# Altium schematic sheet WIFI_BLE.SchDoc: WIFI BLE
size A3; Author: Silvio Navaretti; CompanyName: ARDUINO; DrawnBy: Silvio Navaretti; Engineer: Silvio Navaretti; Organization: ARDUINO; SheetNumber: 29; SheetTotal: 51; RevAuthor: Silvio Navaretti
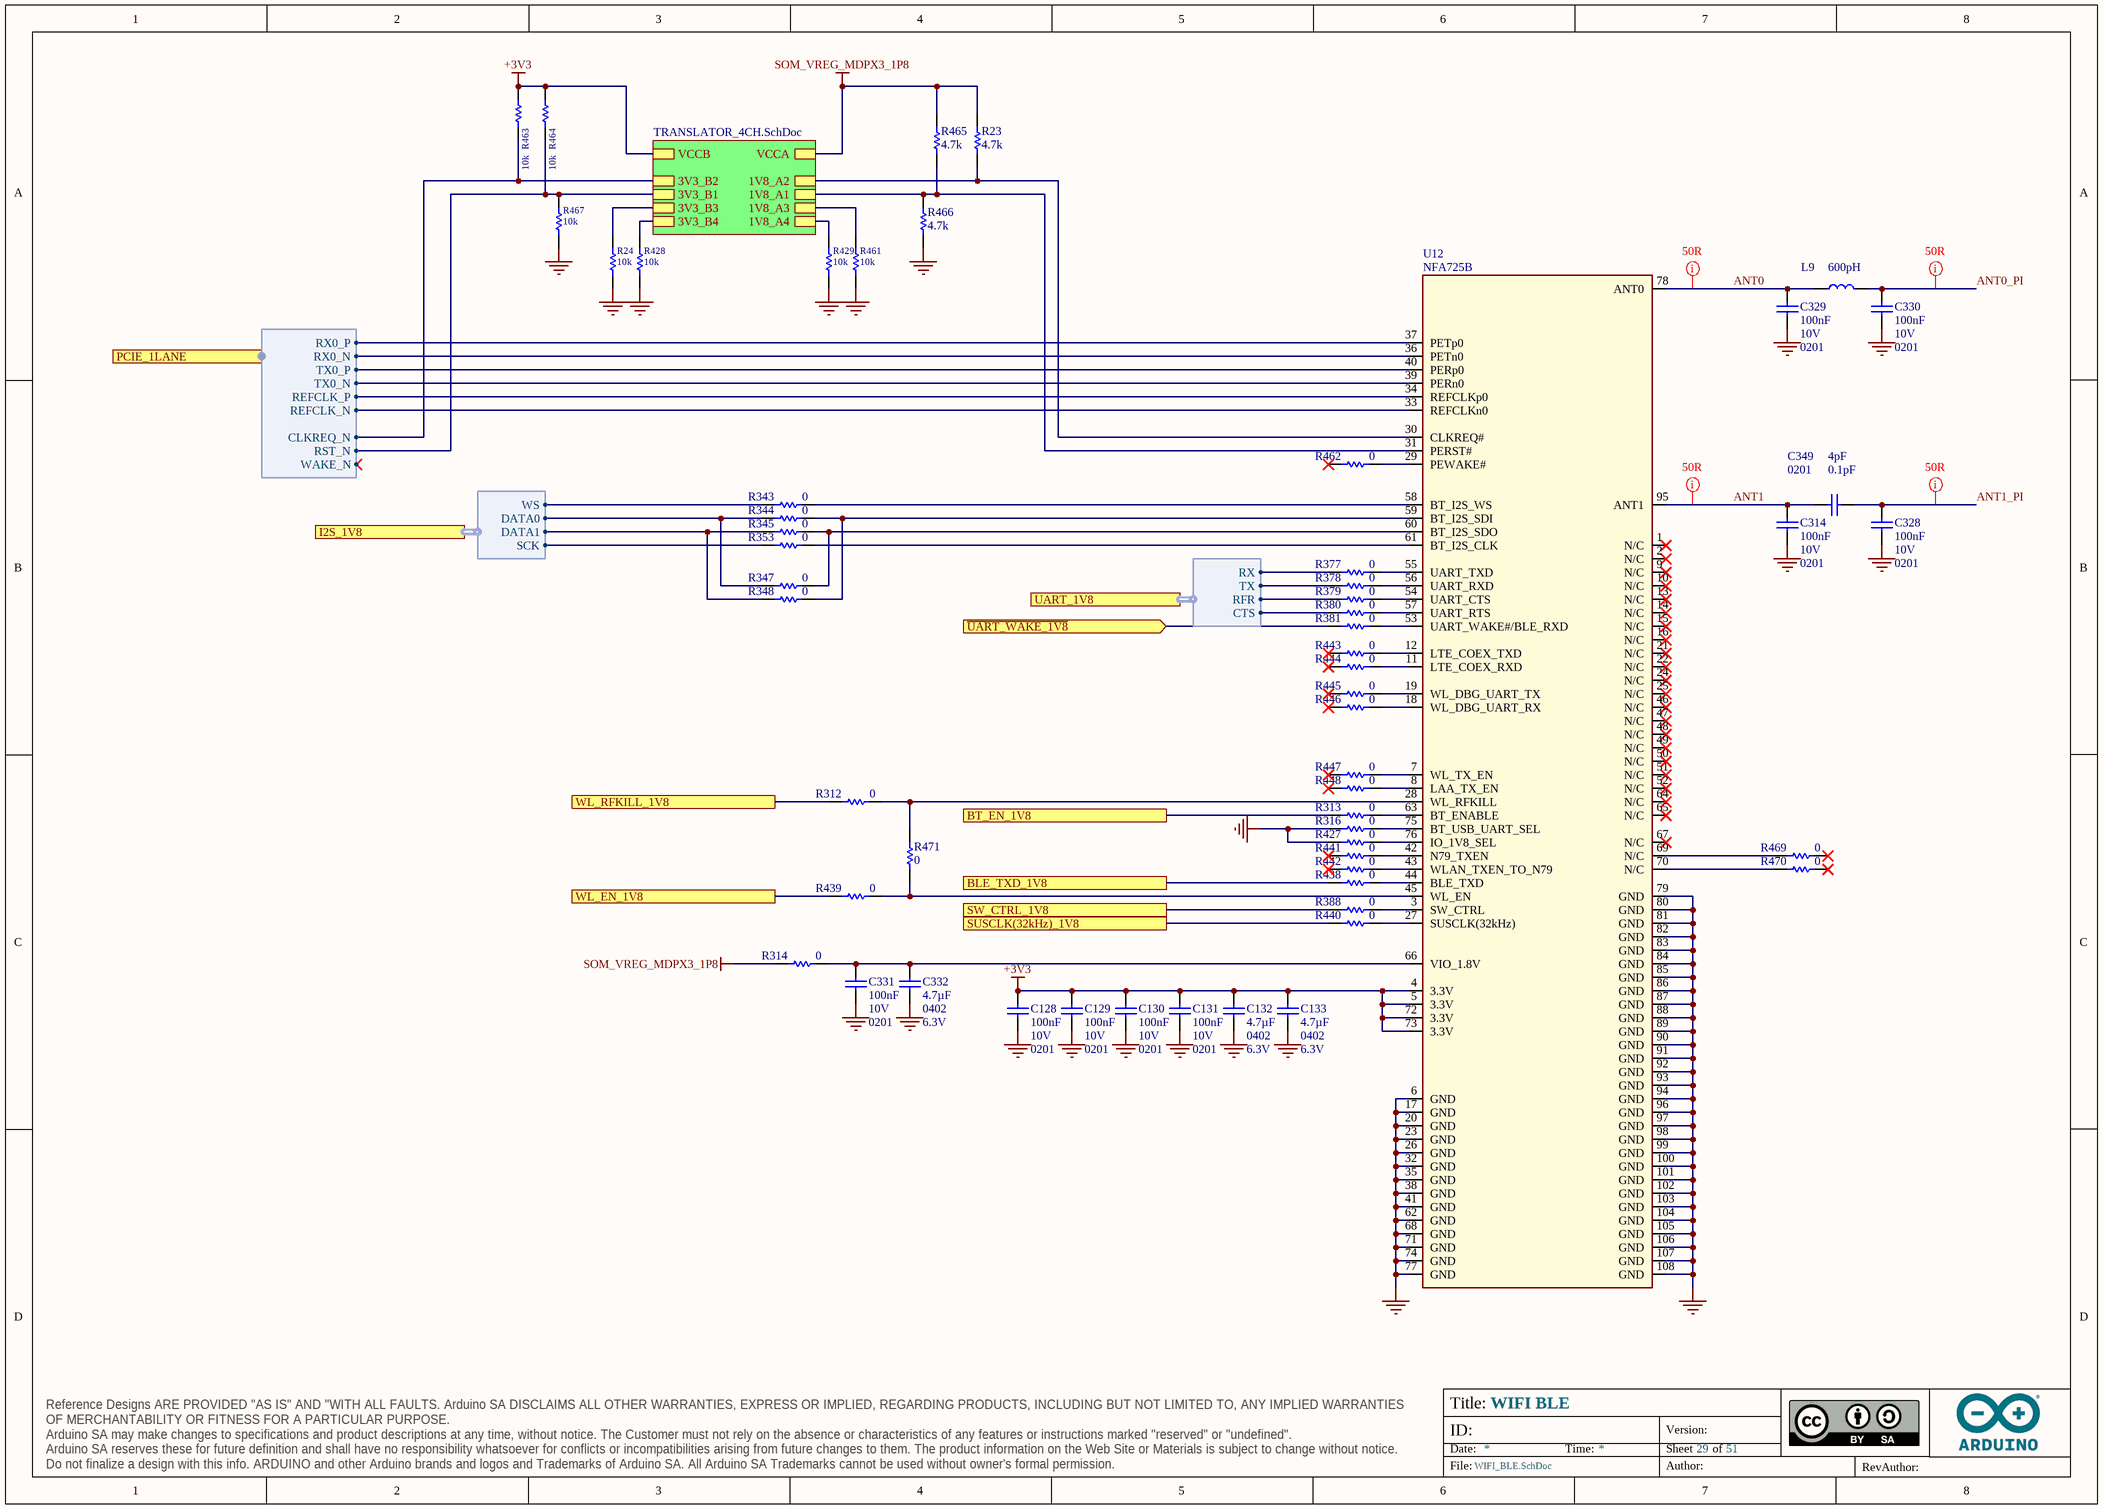
[diagram p0: WIFI_BLE.SchDoc]

## Parts
C128  value 100nF  Voltage: 10V  Case Code (Imperial): 0201  [CAP-0201]  (hidden comment: CL03A104KP3NNNC)
C129  value 100nF  Voltage: 10V  Case Code (Imperial): 0201  [CAP-0201]  (hidden comment: CL03A104KP3NNNC)
C130  value 100nF  Voltage: 10V  Case Code (Imperial): 0201  [CAP-0201]  (hidden comment: CL03A104KP3NNNC)
C131  value 100nF  Voltage: 10V  Case Code (Imperial): 0201  [CAP-0201]  (hidden comment: CL03A104KP3NNNC)
C132  value 4.7µF  Case Code (Imperial): 0402  Voltage: 6.3V  [CAP-0402]  (hidden comment: C1005A475M6R3NT)
C133  value 4.7µF  Case Code (Imperial): 0402  Voltage: 6.3V  [CAP-0402]  (hidden comment: C1005A475M6R3NT)
C314  value 100nF  Voltage: 10V  Case Code (Imperial): 0201  [CAP-0201]  (hidden comment: CL03A104KP3NNNC)
C328  value 100nF  Voltage: 10V  Case Code (Imperial): 0201  [CAP-0201]  (hidden comment: CL03A104KP3NNNC)
C329  value 100nF  Voltage: 10V  Case Code (Imperial): 0201  [CAP-0201]  (hidden comment: CL03A104KP3NNNC)
C330  value 100nF  Voltage: 10V  Case Code (Imperial): 0201  [CAP-0201]  (hidden comment: CL03A104KP3NNNC)
C331  value 100nF  Voltage: 10V  Case Code (Imperial): 0201  [CAP-0201]  (hidden comment: CL03A104KP3NNNC)
C332  value 4.7µF  Case Code (Imperial): 0402  Voltage: 6.3V  [CAP-0402]  (hidden comment: C1005A475M6R3NT)
C349  value 4pF  Case Code (Imperial): 0201  Tolerance: 0.1pF  [CAP-0201]  (hidden comment: GRM0335C1H4R0BA01D)
L9  Inductance: 600pH  [0201DS Coilcraft]  (hidden comment: 0201DS-0N6XKEW)
R23  value 4.7k  [RES-0201]  (hidden comment: RC0201FR-074K7L)
R24  value 10k  [RES-0201]  (hidden comment: RC0201FR-0710KL)
R312  value 0  [RES-0201]  (hidden comment: CRCW02010000Z0ED)
R313  value 0  [RES-0201]  (hidden comment: CRCW02010000Z0ED)
R314  value 0  [RES-0201]  (hidden comment: CRCW02010000Z0ED)
R316  value 0  [RES-0201]  (hidden comment: CRCW02010000Z0ED)
R343  value 0  [RES-0201]  (hidden comment: CRCW02010000Z0ED)
R344  value 0  [RES-0201]  (hidden comment: CRCW02010000Z0ED)
R345  value 0  [RES-0201]  (hidden comment: CRCW02010000Z0ED)
R347  value 0  [RES-0201]  (hidden comment: CRCW02010000Z0ED)
R348  value 0  [RES-0201]  (hidden comment: CRCW02010000Z0ED)
R353  value 0  [RES-0201]  (hidden comment: CRCW02010000Z0ED)
R377  value 0  [RES-0201]  (hidden comment: CRCW02010000Z0ED)
R378  value 0  [RES-0201]  (hidden comment: CRCW02010000Z0ED)
R379  value 0  [RES-0201]  (hidden comment: CRCW02010000Z0ED)
R380  value 0  [RES-0201]  (hidden comment: CRCW02010000Z0ED)
R381  value 0  [RES-0201]  (hidden comment: CRCW02010000Z0ED)
R388  value 0  [RES-0201]  (hidden comment: CRCW02010000Z0ED)
R427  value 0  [RES-0201]  (hidden comment: CRCW02010000Z0ED)
R428  value 10k  [RES-0201]  (hidden comment: RC0201FR-0710KL)
R429  value 10k  [RES-0201]  (hidden comment: RC0201FR-0710KL)
R438  value 0  [RES-0201]  (hidden comment: CRCW02010000Z0ED)
R439  value 0  [RES-0201]  (hidden comment: CRCW02010000Z0ED)
R440  value 0  [RES-0201]  (hidden comment: CRCW02010000Z0ED)
R441  value 0  [RES-0201]  (hidden comment: CRCW02010000Z0ED)
R442  value 0  [RES-0201]  (hidden comment: CRCW02010000Z0ED)
R443  value 0  [RES-0201]  (hidden comment: CRCW02010000Z0ED)
R444  value 0  [RES-0201]  (hidden comment: CRCW02010000Z0ED)
R445  value 0  [RES-0201]  (hidden comment: CRCW02010000Z0ED)
R446  value 0  [RES-0201]  (hidden comment: CRCW02010000Z0ED)
R447  value 0  [RES-0201]  (hidden comment: CRCW02010000Z0ED)
R448  value 0  [RES-0201]  (hidden comment: CRCW02010000Z0ED)
R461  value 10k  [RES-0201]  (hidden comment: RC0201FR-0710KL)
R462  value 0  [RES-0201]  (hidden comment: CRCW02010000Z0ED)
R463  value 10k  [RES-0201]  (hidden comment: RC0201FR-0710KL)
R464  value 10k  [RES-0201]  (hidden comment: RC0201FR-0710KL)
R465  value 4.7k  [RES-0201]  (hidden comment: RC0201FR-074K7L)
R466  value 4.7k  [RES-0201]  (hidden comment: RC0201FR-074K7L)
R467  value 10k  [RES-0201]  (hidden comment: RC0201FR-0710KL)
R469  value 0  [RES-0201]  (hidden comment: CRCW02010000Z0ED)
R470  value 0  [RES-0201]  (hidden comment: CRCW02010000Z0ED)
R471  value 0  [RES-0201]  (hidden comment: CRCW02010000Z0ED)
U12  NFA725B  [NFA725B]

## Sub-sheets
U_TRANSLATOR_4CH = TRANSLATOR_4CH.SchDoc: 1V8_A1, 1V8_A2, 1V8_A3, 1V8_A4, 3V3_B1, 3V3_B2, 3V3_B3, 3V3_B4, VCCA, VCCB

## Ports
BLE_TXD_1V8, BT_EN_1V8, I2S_1V8 (harness SOM_MD_I2S), PCIE_1LANE (harness PCIE_1LANE), SUSCLK(32kHz)_1V8, SW_CTRL_1V8, UART_1V8 (harness SOM_MD_UART_FLCRTL), WL_EN_1V8, WL_RFKILL_1V8, ~{UART_WAKE_1V8} (in)

## Harnesses
SOM_MD_I2S: SCK, WS, DATA0, DATA1
SOM_MD_UART_FLCRTL: TX, CTS, RFR, RX
PCIE_1LANE: RX0_N, RX0_P, TX0_P, TX0_N, REFCLK_N, REFCLK_P, WAKE_N, CLKREQ_N, RST_N

## Nets
+3V3: C128.2 C129.2 C130.2 C131.2 C132.1 C133.1 R463.1 R464.1 U12.4(3.3V) U12.5(3.3V) U12.72(3.3V) U12.73(3.3V) ; sheet U_TRANSLATOR_4CH/VCCB
GND: C128.1 C129.1 C130.1 C131.1 C132.2 C133.2 C314.1 C328.1 C329.1 C330.1 C331.1 C332.2 R24.1 R316.1 R427.1 R428.1 R429.1 R461.1 R466.1 R467.1 U12.6(GND) U12.17(GND) U12.20(GND) U12.23(GND) U12.26(GND) U12.32(GND) U12.35(GND) U12.38(GND) U12.41(GND) U12.62(GND) U12.68(GND) U12.71(GND) U12.74(GND) U12.77(GND) U12.79(GND) U12.80(GND) U12.81(GND) U12.82(GND) U12.83(GND) U12.84(GND) U12.85(GND) U12.86(GND) U12.87(GND) U12.88(GND) U12.89(GND) U12.90(GND) U12.91(GND) U12.92(GND) U12.93(GND) U12.94(GND) U12.96(GND) U12.97(GND) U12.98(GND) U12.99(GND) U12.100(GND) U12.101(GND) U12.102(GND) U12.103(GND) U12.104(GND) U12.105(GND) U12.106(GND) U12.107(GND) U12.108(GND)
SOM_VREG_MDPX3_1P8: R23.2 R314.1 R465.2 ; sheet U_TRANSLATOR_4CH/VCCA
ANT0: C329.2 L9.1 U12.78(ANT0)
ANT0_PI: C330.2 L9.2
ANT1: C314.2 C349.2 U12.95(ANT1)
ANT1_PI: C328.2 C349.1
BLE_TXD_1V8: R438.1 ; port BLE_TXD_1V8
BT_EN_1V8: R313.1 ; port BT_EN_1V8
SUSCLK(32kHz)_1V8: R440.1 ; port SUSCLK(32kHz)_1V8
SW_CTRL_1V8: R388.1 ; port SW_CTRL_1V8
~{UART_WAKE_1V8}: R381.1 ; port ~{UART_WAKE_1V8}
WL_EN_1V8: R439.1 ; port WL_EN_1V8
WL_RFKILL_1V8: R312.1 ; port WL_RFKILL_1V8
NetC331_2: C331.2 C332.1 R314.2 U12.66(VIO_1.8V)
NetR23_1: R23.1 U12.30(CLKREQ#) ; sheet U_TRANSLATOR_4CH/1V8_A2
NetR24_2: R24.2 ; sheet U_TRANSLATOR_4CH/3V3_B3
NetR312_2: R312.2 R471.1 U12.28(WL_RFKILL)
NetR313_2: R313.2 U12.63(BT_ENABLE)
NetR316_2: R316.2 U12.75(BT_USB_UART_SEL)
NetR343_1: R343.1 ; port I2S_1V8.WS
NetR343_2: R343.2 U12.58(BT_I2S_WS)
NetR344_1: R344.1 R347.1 ; port I2S_1V8.DATA0
NetR344_2: R344.2 R348.2 U12.59(BT_I2S_SDI)
NetR345_1: R345.1 R348.1 ; port I2S_1V8.DATA1
NetR345_2: R345.2 R347.2 U12.60(BT_I2S_SDO)
NetR353_1: R353.1 ; port I2S_1V8.SCK
NetR353_2: R353.2 U12.61(BT_I2S_CLK)
NetR377_1: R377.1 ; port UART_1V8.RX
NetR377_2: R377.2 U12.55(UART_TXD)
NetR378_1: R378.1 ; port UART_1V8.TX
NetR378_2: R378.2 U12.56(UART_RXD)
NetR379_1: R379.1 ; port UART_1V8.RFR
NetR379_2: R379.2 U12.54(UART_CTS)
NetR380_1: R380.1 ; port UART_1V8.CTS
NetR380_2: R380.2 U12.57(UART_RTS)
NetR381_2: R381.2 U12.53(UART_WAKE#/BLE_RXD)
NetR388_2: R388.2 U12.3(SW_CTRL)
NetR427_2: R427.2 U12.76(IO_1V8_SEL)
NetR428_2: R428.2 ; sheet U_TRANSLATOR_4CH/3V3_B4
NetR429_2: R429.2 ; sheet U_TRANSLATOR_4CH/1V8_A4
NetR438_2: R438.2 U12.44(BLE_TXD)
NetR439_2: R439.2 R471.2 U12.45(WL_EN)
NetR440_2: R440.2 U12.27(SUSCLK(32kHz))
NetR441_2: R441.2 U12.42(N79_TXEN)
NetR442_2: R442.2 U12.43(WLAN_TXEN_TO_N79)
NetR443_2: R443.2 U12.12(LTE_COEX_TXD)
NetR444_2: R444.2 U12.11(LTE_COEX_RXD)
NetR445_2: R445.2 U12.19(WL_DBG_UART_TX)
NetR446_2: R446.2 U12.18(WL_DBG_UART_RX)
NetR447_2: R447.2 U12.7(WL_TX_EN)
NetR448_2: R448.2 U12.8(LAA_TX_EN)
NetR461_2: R461.2 ; sheet U_TRANSLATOR_4CH/1V8_A3
NetR462_2: R462.2 U12.29(PEWAKE#)
NetR463_2: R463.2 ; sheet U_TRANSLATOR_4CH/3V3_B2, port PCIE_1LANE.CLKREQ_N
NetR464_2: R464.2 R467.2 ; sheet U_TRANSLATOR_4CH/3V3_B1, port PCIE_1LANE.RST_N
NetR465_1: R465.1 R466.2 U12.31(PERST#) ; sheet U_TRANSLATOR_4CH/1V8_A1
NetR469_1: R469.1 U12.69(N/C)
NetR470_1: R470.1 U12.70(N/C)
NetU12_33: U12.33(REFCLKn0) ; port PCIE_1LANE.REFCLK_N
NetU12_34: U12.34(REFCLKp0) ; port PCIE_1LANE.REFCLK_P
NetU12_36: U12.36(PETn0) ; port PCIE_1LANE.RX0_N
NetU12_37: U12.37(PETp0) ; port PCIE_1LANE.RX0_P
NetU12_39: U12.39(PERn0) ; port PCIE_1LANE.TX0_N
NetU12_40: U12.40(PERp0) ; port PCIE_1LANE.TX0_P

Not connected (* = marked no-connect by the designer): R441 1*; R442 1*; R443 1*; R444 1*; R445 1*; R446 1*; R447 1*; R448 1*; R462 1*; R469 2*; R470 2*; U12 1(N/C)* 2(N/C)* 9(N/C)* 10(N/C)* 13(N/C)* 14(N/C)* 15(N/C)* 16(N/C)* 21(N/C)* 22(N/C)* 24(N/C)* 25(N/C)* 46(N/C)* 47(N/C)* 48(N/C)* 49(N/C)* 50(N/C)* 51(N/C)* 52(N/C)* 64(N/C)* 65(N/C)* 67(N/C)*

## Layout directives
net class 50R: ANT0, ANT0_PI, ANT1, ANT1_PI

## Notes on the sheet
- Title:
- ID:
- Date:
- Time:
- Version:
- Sheet
- of
- RevAuthor:
- Reference Designs ARE PROVIDED "AS IS" AND "WITH ALL FAULTS. Arduino SA DISCLAIMS ALL OTHER WARRANTIES, EXPRESS OR IMPLIED, REGARDING PRODUCTS, INCLUDING BUT NOT LIMITED TO, ANY IMPLIED WARRANTIES OF MERCHANTABILITY OR FITNESS FOR A PARTICULAR PURPOSE.
  Arduino SA may make changes to specifications and product descriptions at any time, without notice. The Customer must not rely on the absence or characteristics of any features or instructions marked "reserved" or "undefined".
  Arduino SA reserves these for future definition and shall have no responsibility whatsoever for conflicts or incompatibilities arising from future changes to them. The product information on the Web Site or Materials is subject to change without notice.
  Do not finalize a design with this info. ARDUINO and other Arduino brands and logos and Trademarks of Arduino SA. All Arduino SA Trademarks cannot be used without owner's formal permission.
- File:
- Author:

## Library data of the parts
C128-C131 C314 C328-C331 = C0113-A.6: CAP CHIP 0201 100nF 10% 10V X5R; Manufacturer: Samsung Electro-Mechanics; Code Arduino: C0113; Technology: Ceramic; Part Number: CL03A104KP3NNNC; Dielectric: X5R; Tolerance: 10%
C132 C133 C332 = C0037-A.14: CAP CHIP 0402 4.7uF 20% 6V3 X5R; Manufacturer: Hottech; Code Arduino: 0833; Dielectric: X5R; Technology: Ceramic; Part Number: C1005A475M6R3NT; Manufacturer 2: Samsung Electro-Mechanics; Tolerance: 20%; Manufacturer 3: Murata Electronics; Part number 3: GRM155R60J475ME47D; Part number 2: CL05A475KQ5NRNC
C349 = C0210-A.1: CAP CHIP 0201 4pF 0.1pF 50V C0G; Manufacturer: Murata; Code Arduino: C0210; Technology: Ceramic; Part Number: GRM0335C1H4R0BA01D; Voltage: 50V; Dielectric: C0G
L9 = I0132-A.2: IND 0201 0.6nH 1A 30mR; Code Arduino: I0132; DCR max: 30m; Part Number: 0201DS-0N6XKEW
R23 R465 R466 = R0151-A.21: RES CHIP 0201 4k7 1% 1/20W; Manufacturer: Yageo; Power: 50mW; Temperature coefficient: 200ppm; Code Arduino: A5521; Tolerance: 1%; Case Code (Imperial): 0201; Part Number: RC0201FR-074K7L; Technology: Thick film
R24 R428 R429 R461 R463 R464 R467 = R0145-A.21: RES CHIP 0201 10k 1% 1/20W; Manufacturer: Yageo; Power: 50mW; Temperature coefficient: 200ppm; Code Arduino: R0145; Manufacturer 2: Samsung Electro-Mechanics; Tolerance: 1%; Case Code (Imperial): 0201; Part Number: RC0201FR-0710KL; Technology: Thick film
R312-R314 R316 R343-R345 R347 R348 R353 R377-R381 R388 R427 R438-R448 R462 R469-R471 = R0140-A.21: RES CHIP 0201 0R; Manufacturer: Vishay; Temperature coefficient: 0ppm; Code Arduino: R0140; Power: 50mW; Tolerance: 0%; Technology: Thick film; Case Code (Imperial): 0201; Part Number: CRCW02010000Z0ED
U12 = M0030-A.15: Module 802.11a/b/g/n/ac/ax 2x2 MAC + BT 5.2, QCA2066, with 2 antenna pads, PCIe, LGA76 14x17.68mm; Manufacturer: USI; Code Arduino: M0030; Part Number: NFA725B